# Altium schematic sheet wh1602_buttons_and_encoder.SchDoc
size A4
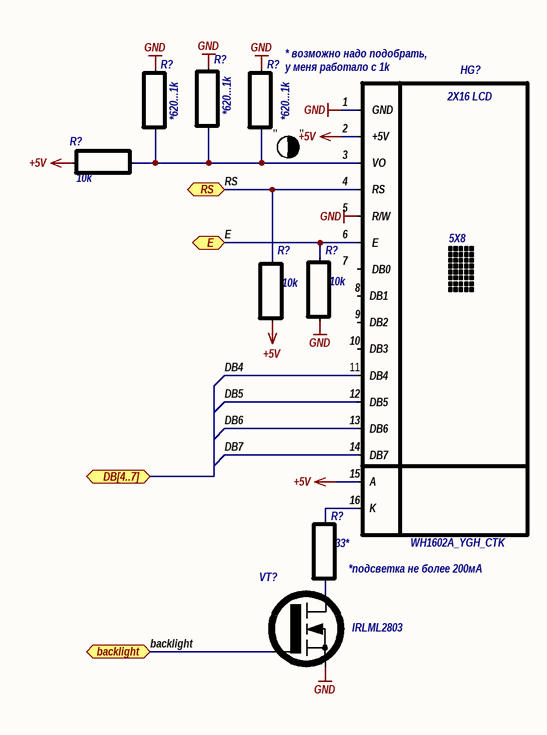
[diagram p0: wh1602_buttons_and_encoder.SchDoc]

## Parts
(Parts that share a designator on the sheet are numbered #1, #2 ... from top to bottom, then left to right.)
HG?  WH1602A_YGH_CTK  [WH1602A_YGH_CTK]
R?#1  *620...1k  [R0402]
R?#2  *620...1k  [R0402]
R?#3  *620...1k  [R0402]
R?#4  10k  [R0402]
R?#5  10k  [R0402]
R?#6  10k  [R0402]
R?#7  33*  [R0805]
VT?  IRLML2803  [SOT23]

## Ports
backlight, DB[4..7], E, RS

## Nets
+5V: HG?.2(+5V) HG?.15(A) R?#4.1 R?#5.1
GND: HG?.1(GND) HG?.5(R/W) R?#1.2 R?#2.2 R?#3.2 R?#6.1 VT?.2(source)
backlight: VT?.1(gate) ; port backlight
DB4: HG?.11(DB4)
DB5: HG?.12(DB5)
DB6: HG?.13(DB6)
DB7: HG?.14(DB7)
E: HG?.6(E) R?#6.2 ; port E
RS: HG?.4(RS) R?#5.2 ; port RS
NetHG?_3: HG?.3(VO) R?#1.1 R?#2.1 R?#3.1 R?#4.2
NetHG?_16: HG?.16(K) R?#7.2
NetR?#7_1: R?#7.1 VT?.3(drain)

Not connected (* = marked no-connect by the designer): HG? 7(DB0) 8(DB1) 9(DB2) 10(DB3) A G K

## Notes on the sheet
- (near R?#3) * возможно надо подобрать,
- у меня работало с 1k
- (near R?#3) "
- "
- *подсветка не более 200мА
- (in symbol WH1602A_YGH_CTK) 2X16 LCD; 5X8

## Library data of the parts
R?#1-R?#7 = Resistor_russian: Resistor
  R?#1-R?#3: Value: *620...1k
  R?#4-R?#6: Value: 10k
  R?#7: Value: 33*
VT? = IRLML2803: HEXFET® Power MOSFET; Value: IRLML2803
HG? = WH1602A_YGH_CTK: Value: *